# EAGLE schematic cooler (EAGLE 9.1.0)
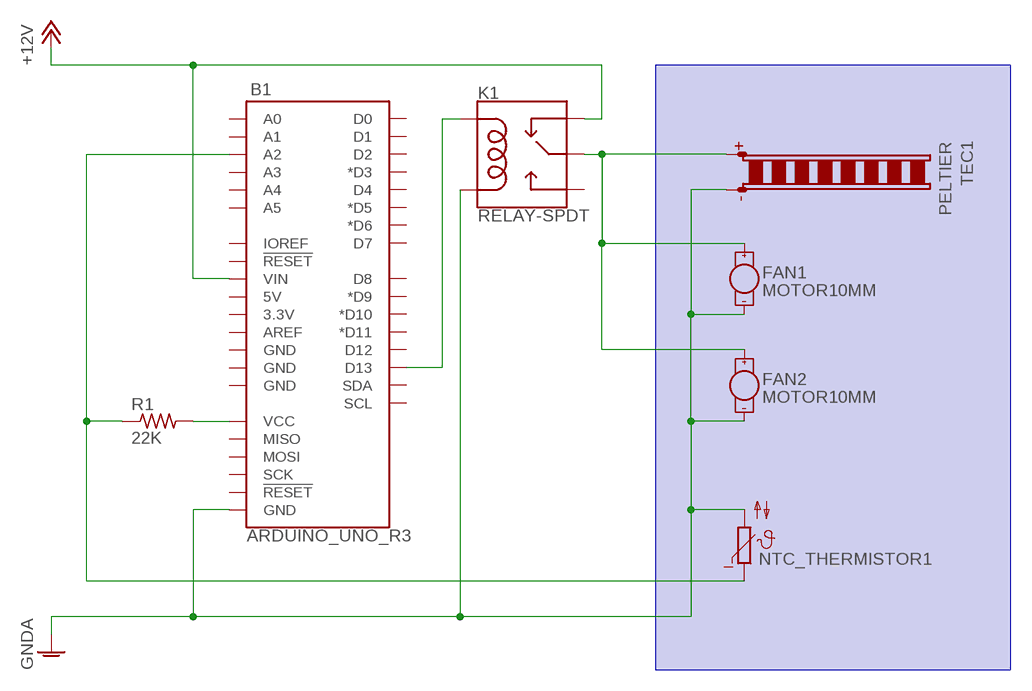
[diagram p0: schematic, sheet 1]

## Parts
B1  ARDUINO_UNO_R3  [ARDUINO_R3]
FAN1  MOTOR10MM  [VIBE-MOTOR-10MM]
FAN2  MOTOR10MM  [VIBE-MOTOR-10MM]
K1  RELAY-SPDT  [RELAY_G5LE]
NTC_THERMISTOR1  B57164  [B57164]
R1  22K  R-US_0204/5  [0204/5]
TEC1  PELTIER  [R_V526-0]

## Nets
+12V: B1.VIN K1.4(NC)
GNDA: B1.GND@1(GND) FAN1.- FAN2.- K1.5(COIL2) NTC_THERMISTOR1.2 TEC1.2
N$1: B1.A2 NTC_THERMISTOR1.1 R1.1
N$2: B1.D13 K1.2(COIL1)
N$3: FAN1.+ FAN2.+ K1.1(MAIN) TEC1.1
N$4: B1.VCC R1.2
Unconnected: B1.3.3V B1.5V B1.A0 B1.A1 B1.A3 B1.A4 B1.A5 B1.AREF B1.D0 B1.D1 B1.D2 B1.D3(*D3) B1.D4 B1.D5(*D5) B1.D6(*D6) B1.D7 B1.D8 B1.D9(*D9) B1.D10(*D10) B1.D11(*D11) B1.D12 B1.GND@2(GND) B1.GND@3(GND) B1.GND@4(GND) B1.IOREF B1.MISO B1.MOSI B1.RESET@1(!RESET!) B1.RESET@2(!RESET!) B1.SCK B1.SCL B1.SDA K1.3(NO)

## Library data of the parts
B1 = SparkFun-Boards:ARDUINO_UNO_R3: Arduino R3 Footprint with SPI header Arduino Uno R3 Compatible Footprint. Matches PCB size of the original board. SparkFun Products: SAMD21 Dev Breakout <https://www.sparkfun.com/products/13672> RedBoard <https://www.sparkfun.com/products/12757> R3 Stackable Headers <https://www.sparkfun.com/products/11417>
FAN1 FAN2 = SparkFun-Electromechanical:MOTOR: Motor (Single-Phase) Two-terminal, single-phase motors. SparkFun Products Vibration Motor <https://www.sparkfun.com/products/8449> (ROB-08449) Physical dimension and wire connections for this powerful vibration motor. Motor has a self adhesive backing.; PROD_ID: COMP-08572; SF_SKU: ROB-08449
K1 = SparkFun-Electromechanical:RELAY-SPDT: SPDT Electromechanical Relay Single-pole, double-throw sealed relays. When current is applied to the coil, it throws a simple changeover switch, terminating the connection from the NC contact to ground and closing the NO contact. Use them to switch high voltage/high current devices. SparkFun Products JQX-15F: Relay SPDT Sealed - 20A <https://www.sparkfun.com/products/10924> (COM-10924) JZC-11F: Relay SPDT Sealed <https://www.sparkfun.com/products/100> (COM-00100); PROD_ID: COMP-14214
NTC_THERMISTOR1 = ptc-ntc:B57164: SIEMENS NTC; MPN: B57164K474K52; OC_FARNELL: 9753451; OC_NEWARK: 29M3118
R1 = resistor:R-US_: RESISTOR, American symbol
TEC1 = stepper_drivers_etc:PELTIER